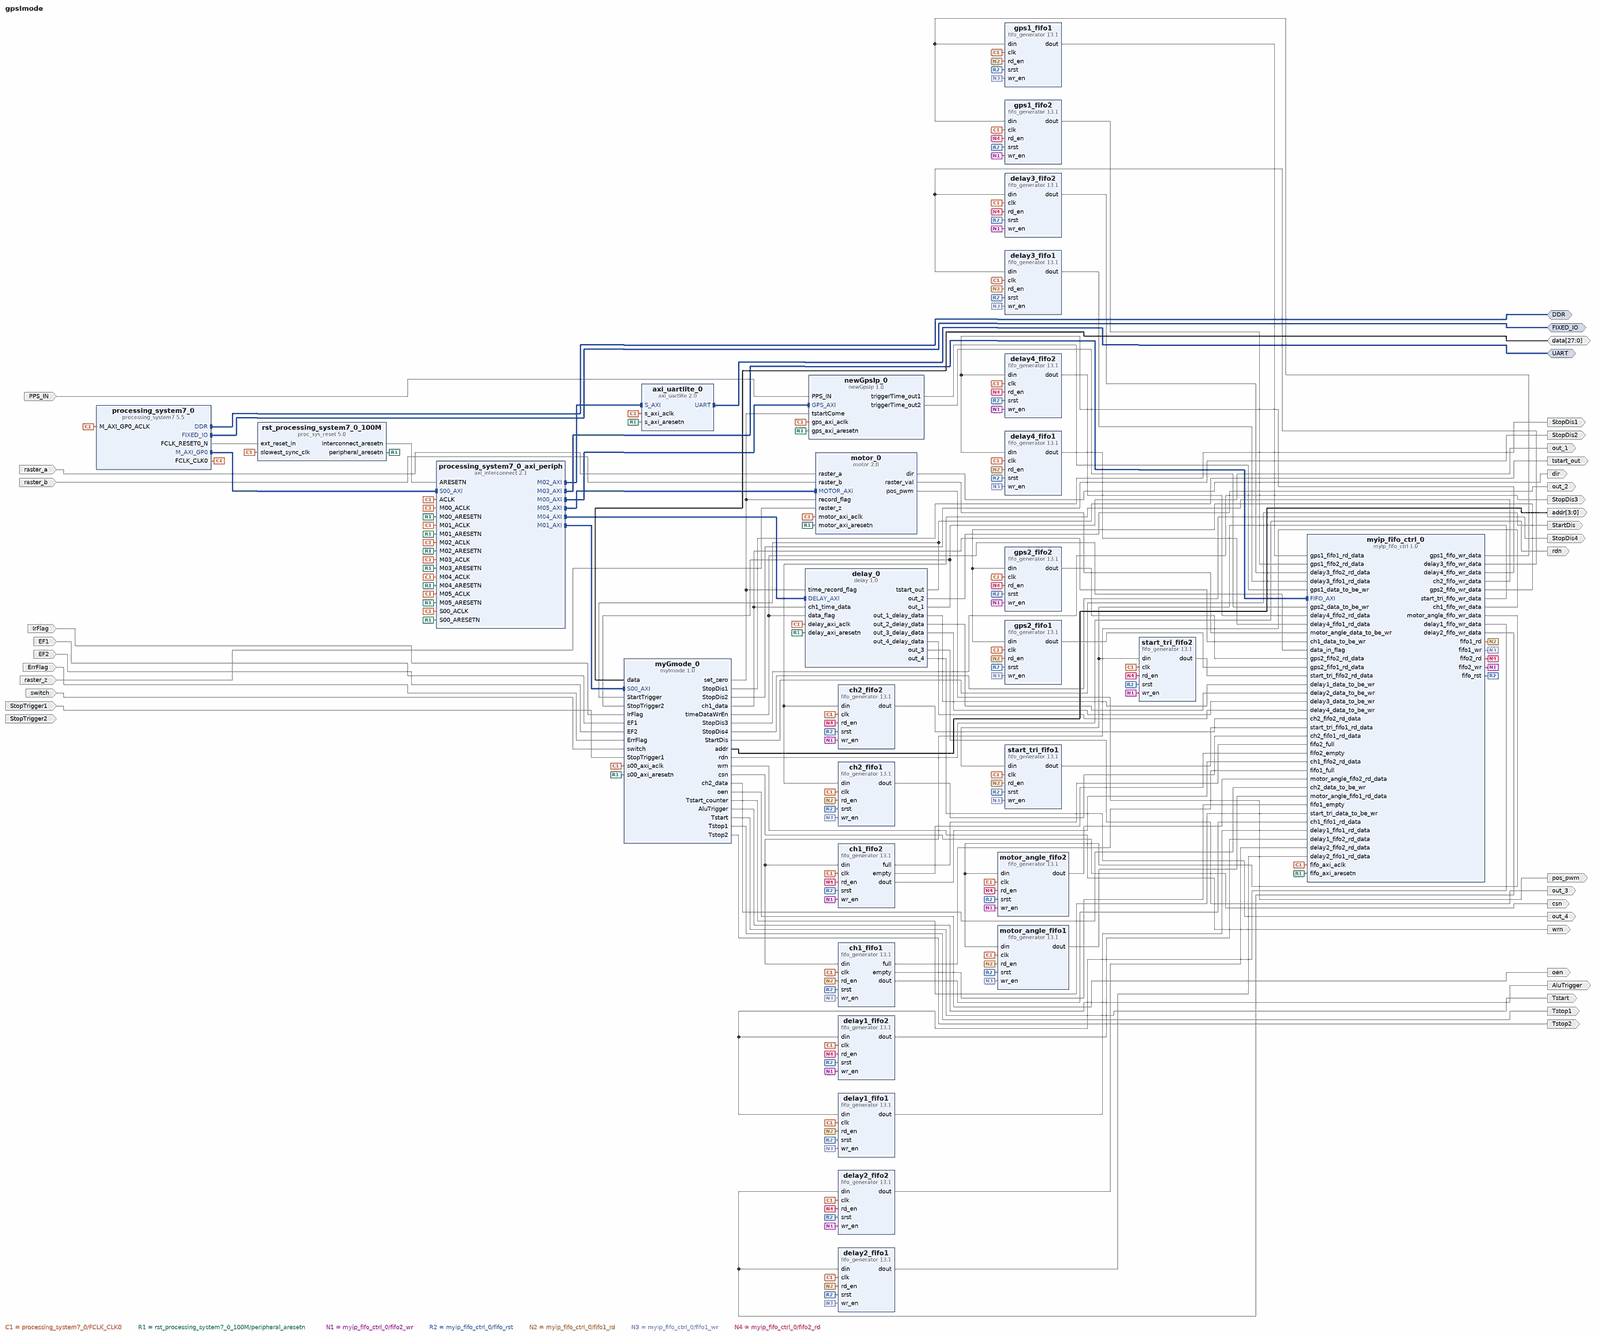
[diagram p0: block diagram of the top level, whole]
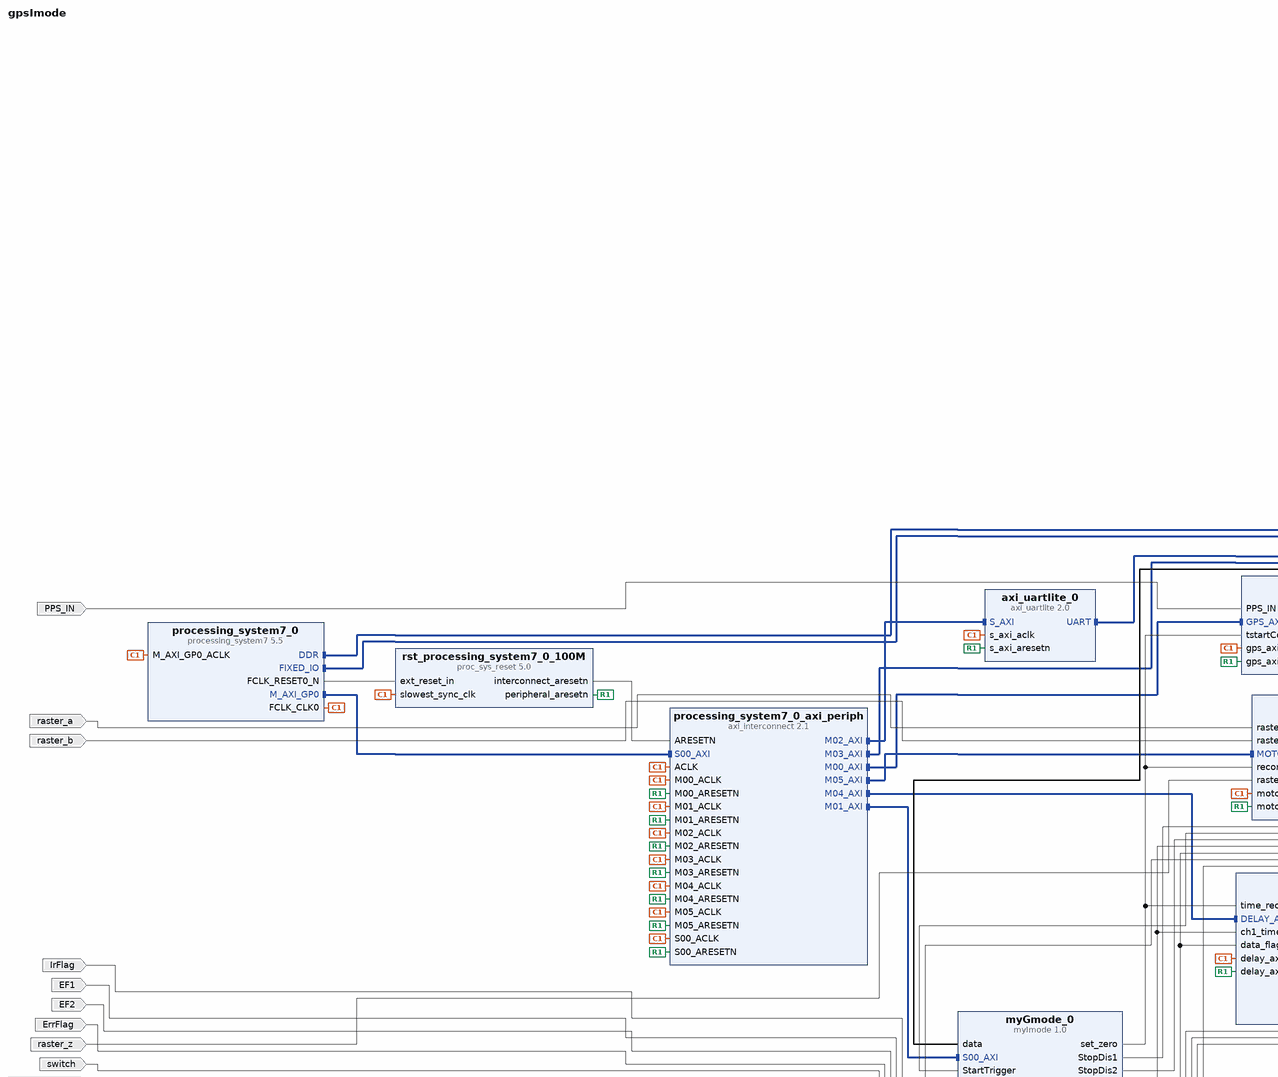
[diagram p1: block diagram of the top level, upper left part]
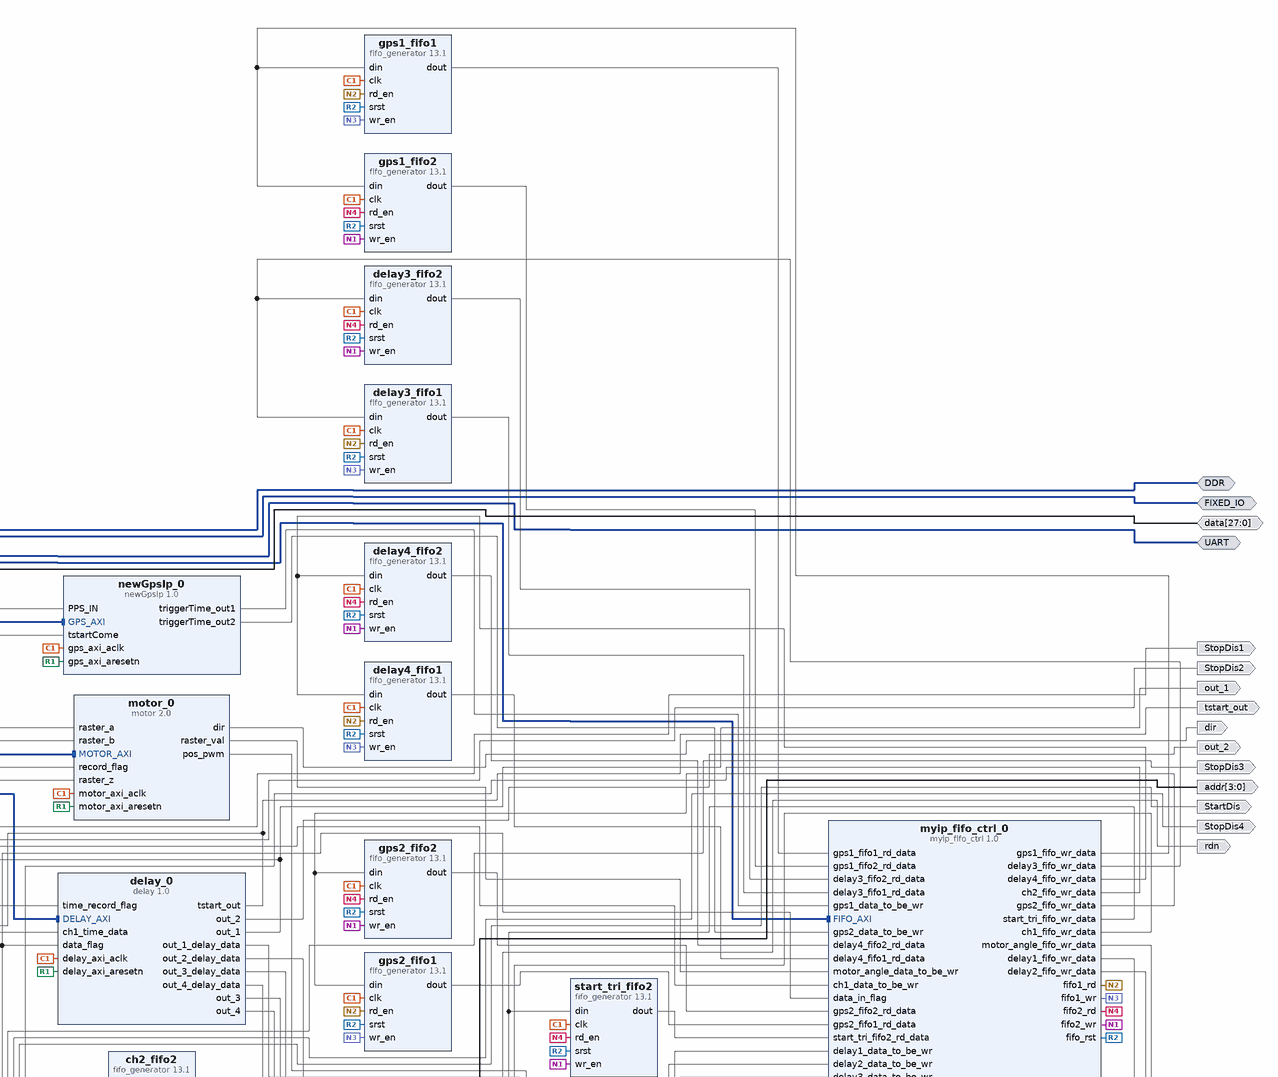
[diagram p2: block diagram of the top level, upper right part]
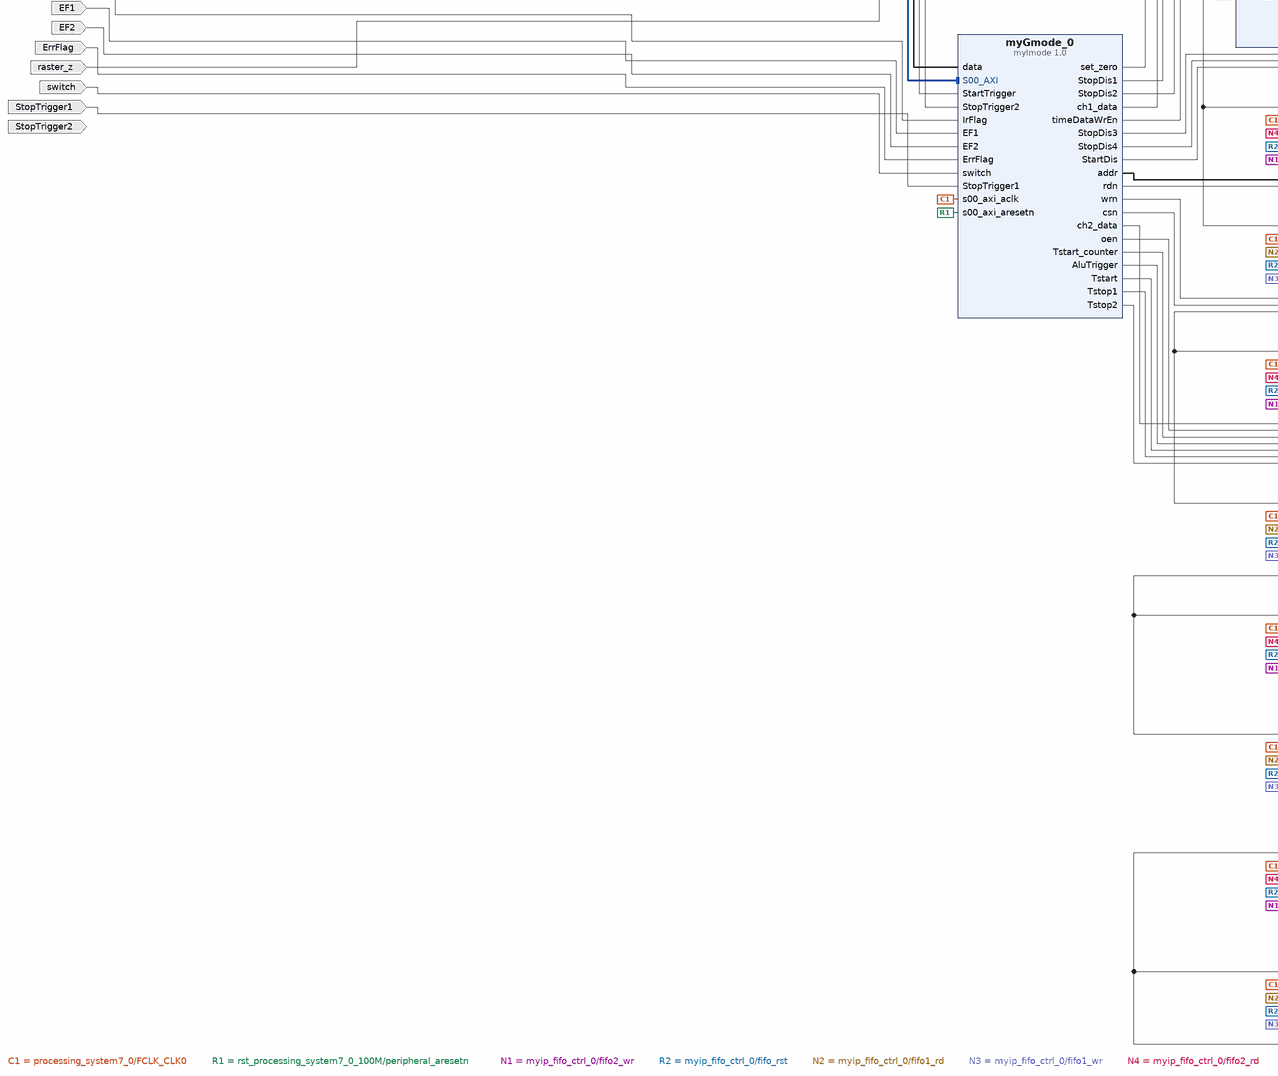
[diagram p3: block diagram of the top level, lower left part]
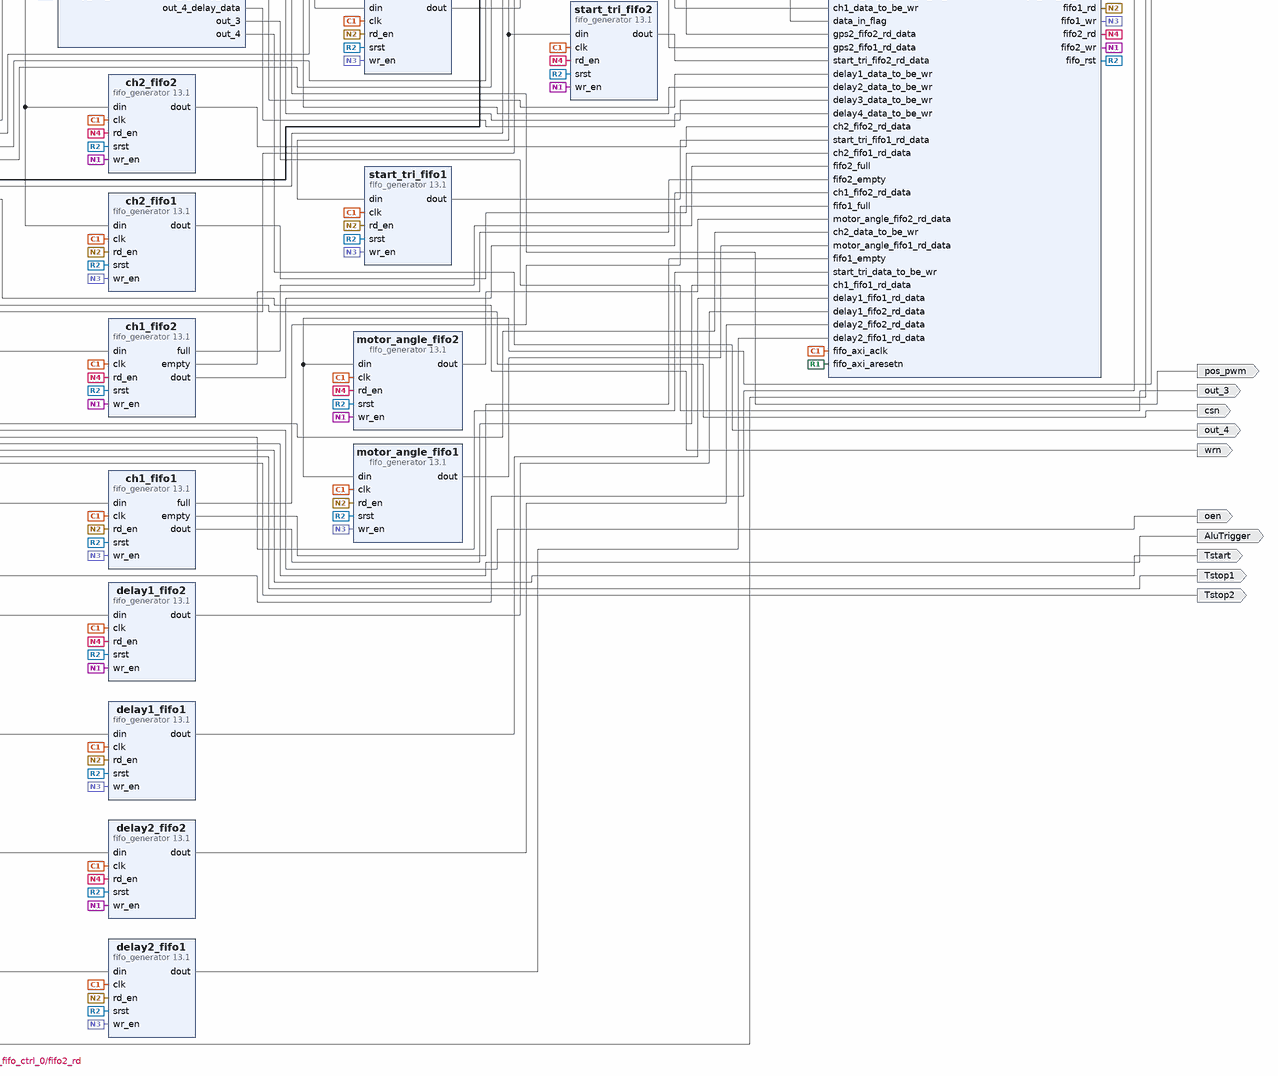
[diagram p4: block diagram of the top level, lower right part]
# Vivado block design gpsImode, Vivado 2016.2
create_bd_design gpsImode

create_bd_intf_port -mode Master -vlnv xilinx.com:interface:ddrx_rtl:1.0 DDR
create_bd_intf_port -mode Master -vlnv xilinx.com:display_processing_system7:fixedio_rtl:1.0 FIXED_IO
create_bd_intf_port -mode Master -vlnv xilinx.com:interface:uart_rtl:1.0 UART
create_bd_port -dir I StopTrigger2
create_bd_port -dir I PPS_IN
create_bd_port -dir I IrFlag
create_bd_port -dir I EF1
create_bd_port -dir O StopDis1
create_bd_port -dir O StopDis2
create_bd_port -dir O StopDis3
create_bd_port -dir O StopDis4
create_bd_port -dir O StartDis
create_bd_port -dir O -from 3 -to 0 addr
create_bd_port -dir IO -from 27 -to 0 data
create_bd_port -dir O wrn
create_bd_port -dir O rdn
create_bd_port -dir O csn
create_bd_port -dir O oen
create_bd_port -dir O AluTrigger
create_bd_port -dir O Tstart
create_bd_port -dir O Tstop1
create_bd_port -dir O Tstop2
create_bd_port -dir I EF2
create_bd_port -dir I ErrFlag
create_bd_port -dir I switch
create_bd_port -dir O out_2
create_bd_port -dir O out_3
create_bd_port -dir O tstart_out
create_bd_port -dir O out_1
create_bd_port -dir O out_4
create_bd_port -dir I StopTrigger1
create_bd_port -dir I raster_a
create_bd_port -dir I raster_b
create_bd_port -dir I raster_z
create_bd_port -dir O pos_pwm
create_bd_port -dir O dir

create_bd_cell -type ip -vlnv xilinx.com:ip:processing_system7:5.5 processing_system7_0
set_property -dict [list \
  CONFIG.PCW_USE_FABRIC_INTERRUPT 1 \
  CONFIG.PCW_IRQ_F2P_INTR 1 \
  CONFIG.PCW_QSPI_GRP_SINGLE_SS_ENABLE 1 \
  CONFIG.preset ZedBoard \
] [get_bd_cells processing_system7_0]
create_bd_cell -type ip -vlnv xilinx.com:ip:axi_uartlite:2.0 axi_uartlite_0
create_bd_cell -type ip -vlnv xilinx.com:ip:axi_interconnect:2.1 processing_system7_0_axi_periph
set_property -dict {CONFIG.NUM_MI 6} [get_bd_cells processing_system7_0_axi_periph]
create_bd_cell -type ip -vlnv xilinx.com:ip:proc_sys_reset:5.0 rst_processing_system7_0_100M
create_bd_cell -type ip -vlnv xilinx.com:ip:fifo_generator:13.1 ch1_fifo1
set_property -dict {CONFIG.Input_Data_Width 22 CONFIG.Input_Depth 8192 CONFIG.Output_Data_Width 22} [get_bd_cells ch1_fifo1]
create_bd_cell -type ip -vlnv xilinx.com:ip:fifo_generator:13.1 ch1_fifo2
set_property -dict {CONFIG.Input_Data_Width 22 CONFIG.Input_Depth 8192 CONFIG.Output_Data_Width 22} [get_bd_cells ch1_fifo2]
create_bd_cell -type ip -vlnv xilinx.com:ip:fifo_generator:13.1 ch2_fifo1
set_property -dict {CONFIG.Input_Data_Width 22 CONFIG.Input_Depth 8192 CONFIG.Output_Data_Width 22} [get_bd_cells ch2_fifo1]
create_bd_cell -type ip -vlnv xilinx.com:ip:fifo_generator:13.1 ch2_fifo2
set_property -dict {CONFIG.Input_Data_Width 22 CONFIG.Input_Depth 8192 CONFIG.Output_Data_Width 22} [get_bd_cells ch2_fifo2]
create_bd_cell -type ip -vlnv xilinx.com:ip:fifo_generator:13.1 gps1_fifo1
set_property -dict {CONFIG.Input_Data_Width 32 CONFIG.Input_Depth 8192 CONFIG.Output_Data_Width 32} [get_bd_cells gps1_fifo1]
create_bd_cell -type ip -vlnv xilinx.com:ip:fifo_generator:13.1 gps1_fifo2
set_property -dict {CONFIG.Input_Data_Width 32 CONFIG.Input_Depth 8192 CONFIG.Output_Data_Width 32} [get_bd_cells gps1_fifo2]
create_bd_cell -type ip -vlnv xilinx.com:ip:fifo_generator:13.1 gps2_fifo1
set_property -dict {CONFIG.Input_Data_Width 32 CONFIG.Input_Depth 8192 CONFIG.Output_Data_Width 32} [get_bd_cells gps2_fifo1]
create_bd_cell -type ip -vlnv xilinx.com:ip:fifo_generator:13.1 gps2_fifo2
set_property -dict {CONFIG.Input_Data_Width 32 CONFIG.Input_Depth 8192 CONFIG.Output_Data_Width 32} [get_bd_cells gps2_fifo2]
create_bd_cell -type ip -vlnv xilinx.com:ip:fifo_generator:13.1 start_tri_fifo1
set_property -dict {CONFIG.Input_Data_Width 32 CONFIG.Input_Depth 8192 CONFIG.Output_Data_Width 32} [get_bd_cells start_tri_fifo1]
create_bd_cell -type ip -vlnv xilinx.com:ip:fifo_generator:13.1 start_tri_fifo2
set_property -dict {CONFIG.Input_Data_Width 32 CONFIG.Input_Depth 8192 CONFIG.Output_Data_Width 32} [get_bd_cells start_tri_fifo2]
create_bd_cell -type ip -vlnv xilinx.com:user:newGpsIp:1.0 newGpsIp_0
create_bd_cell -type ip -vlnv xilinx.com:user:myImode:1.0 myGmode_0
create_bd_cell -type ip -vlnv xilinx.com:ip:fifo_generator:13.1 delay1_fifo1
set_property -dict {CONFIG.Input_Data_Width 15 CONFIG.Input_Depth 8192 CONFIG.Output_Data_Width 15} [get_bd_cells delay1_fifo1]
create_bd_cell -type ip -vlnv xilinx.com:ip:fifo_generator:13.1 delay1_fifo2
set_property -dict {CONFIG.Input_Data_Width 15 CONFIG.Input_Depth 8192 CONFIG.Output_Data_Width 15} [get_bd_cells delay1_fifo2]
create_bd_cell -type ip -vlnv xilinx.com:ip:fifo_generator:13.1 delay2_fifo1
set_property -dict {CONFIG.Input_Data_Width 15 CONFIG.Input_Depth 8192 CONFIG.Output_Data_Width 15} [get_bd_cells delay2_fifo1]
create_bd_cell -type ip -vlnv xilinx.com:ip:fifo_generator:13.1 delay2_fifo2
set_property -dict {CONFIG.Input_Data_Width 15 CONFIG.Input_Depth 8192 CONFIG.Output_Data_Width 15} [get_bd_cells delay2_fifo2]
create_bd_cell -type ip -vlnv xilinx.com:ip:fifo_generator:13.1 delay3_fifo1
set_property -dict {CONFIG.Input_Data_Width 15 CONFIG.Input_Depth 8192 CONFIG.Output_Data_Width 15} [get_bd_cells delay3_fifo1]
create_bd_cell -type ip -vlnv xilinx.com:ip:fifo_generator:13.1 delay3_fifo2
set_property -dict {CONFIG.Input_Data_Width 15 CONFIG.Input_Depth 8192 CONFIG.Output_Data_Width 15} [get_bd_cells delay3_fifo2]
create_bd_cell -type ip -vlnv xilinx.com:ip:fifo_generator:13.1 delay4_fifo1
set_property -dict {CONFIG.Input_Data_Width 15 CONFIG.Input_Depth 8192 CONFIG.Output_Data_Width 15} [get_bd_cells delay4_fifo1]
create_bd_cell -type ip -vlnv xilinx.com:ip:fifo_generator:13.1 delay4_fifo2
set_property -dict {CONFIG.Input_Data_Width 15 CONFIG.Input_Depth 8192 CONFIG.Output_Data_Width 15} [get_bd_cells delay4_fifo2]
create_bd_cell -type ip -vlnv xilinx.com:user:delay:1.0 delay_0
create_bd_cell -type ip -vlnv xilinx.com:user:myip_fifo_ctrl:1.0 myip_fifo_ctrl_0
create_bd_cell -type ip -vlnv xilinx.com:ip:fifo_generator:13.1 motor_angle_fifo1
set_property -dict [list \
  CONFIG.Input_Data_Width 32 \
  CONFIG.Input_Depth 8192 \
  CONFIG.Output_Data_Width 32 \
] [get_bd_cells motor_angle_fifo1]
create_bd_cell -type ip -vlnv xilinx.com:ip:fifo_generator:13.1 motor_angle_fifo2
set_property -dict [list \
  CONFIG.Input_Data_Width 32 \
  CONFIG.Input_Depth 8192 \
  CONFIG.Output_Data_Width 32 \
] [get_bd_cells motor_angle_fifo2]
create_bd_cell -type ip -vlnv xilinx.com:user:motor:2.0 motor_0

# ---- connections ----

connect_bd_intf_net [get_bd_intf_pins processing_system7_0/M_AXI_GP0] [get_bd_intf_pins processing_system7_0_axi_periph/S00_AXI]
connect_bd_intf_net [get_bd_intf_pins processing_system7_0_axi_periph/M00_AXI] [get_bd_intf_pins newGpsIp_0/GPS_AXI]
connect_bd_intf_net [get_bd_intf_pins processing_system7_0_axi_periph/M02_AXI] [get_bd_intf_pins axi_uartlite_0/S_AXI]
connect_bd_intf_net [get_bd_intf_pins processing_system7_0_axi_periph/M01_AXI] [get_bd_intf_pins myGmode_0/S00_AXI]
connect_bd_intf_net [get_bd_intf_pins processing_system7_0_axi_periph/M03_AXI] [get_bd_intf_pins myip_fifo_ctrl_0/FIFO_AXI]
connect_bd_intf_net [get_bd_intf_pins processing_system7_0_axi_periph/M04_AXI] [get_bd_intf_pins delay_0/DELAY_AXI]
connect_bd_intf_net [get_bd_intf_pins processing_system7_0_axi_periph/M05_AXI] [get_bd_intf_pins motor_0/MOTOR_AXI]
connect_bd_intf_net [get_bd_intf_ports DDR] [get_bd_intf_pins processing_system7_0/DDR]
connect_bd_intf_net [get_bd_intf_ports FIXED_IO] [get_bd_intf_pins processing_system7_0/FIXED_IO]
connect_bd_intf_net [get_bd_intf_ports UART] [get_bd_intf_pins axi_uartlite_0/UART]
connect_bd_net [get_bd_ports PPS_IN] [get_bd_pins newGpsIp_0/PPS_IN]
connect_bd_net [get_bd_pins processing_system7_0/FCLK_CLK0] \
  [get_bd_pins processing_system7_0/M_AXI_GP0_ACLK] [get_bd_pins rst_processing_system7_0_100M/slowest_sync_clk] \
  [get_bd_pins axi_uartlite_0/s_axi_aclk] [get_bd_pins ch1_fifo1/clk] [get_bd_pins ch2_fifo1/clk] \
  [get_bd_pins gps2_fifo1/clk] [get_bd_pins start_tri_fifo1/clk] [get_bd_pins ch1_fifo2/clk] [get_bd_pins ch2_fifo2/clk] \
  [get_bd_pins gps1_fifo2/clk] [get_bd_pins gps2_fifo2/clk] [get_bd_pins start_tri_fifo2/clk] [get_bd_pins gps1_fifo1/clk] \
  [get_bd_pins newGpsIp_0/gps_axi_aclk] [get_bd_pins myGmode_0/s00_axi_aclk] [get_bd_pins delay1_fifo1/clk] \
  [get_bd_pins delay1_fifo2/clk] [get_bd_pins delay2_fifo1/clk] [get_bd_pins delay2_fifo2/clk] [get_bd_pins delay3_fifo1/clk] \
  [get_bd_pins delay3_fifo2/clk] [get_bd_pins delay4_fifo1/clk] [get_bd_pins delay4_fifo2/clk] \
  [get_bd_pins delay_0/delay_axi_aclk] [get_bd_pins myip_fifo_ctrl_0/fifo_axi_aclk] [get_bd_pins motor_angle_fifo1/clk] \
  [get_bd_pins motor_angle_fifo2/clk] [get_bd_pins processing_system7_0_axi_periph/S00_ACLK] \
  [get_bd_pins processing_system7_0_axi_periph/ACLK] [get_bd_pins processing_system7_0_axi_periph/M00_ACLK] \
  [get_bd_pins processing_system7_0_axi_periph/M01_ACLK] [get_bd_pins processing_system7_0_axi_periph/M02_ACLK] \
  [get_bd_pins processing_system7_0_axi_periph/M03_ACLK] [get_bd_pins processing_system7_0_axi_periph/M04_ACLK] \
  [get_bd_pins processing_system7_0_axi_periph/M05_ACLK] [get_bd_pins motor_0/motor_axi_aclk]
connect_bd_net [get_bd_pins processing_system7_0/FCLK_RESET0_N] [get_bd_pins rst_processing_system7_0_100M/ext_reset_in]
connect_bd_net [get_bd_pins rst_processing_system7_0_100M/peripheral_aresetn] \
  [get_bd_pins axi_uartlite_0/s_axi_aresetn] [get_bd_pins newGpsIp_0/gps_axi_aresetn] [get_bd_pins myGmode_0/s00_axi_aresetn] \
  [get_bd_pins delay_0/delay_axi_aresetn] [get_bd_pins myip_fifo_ctrl_0/fifo_axi_aresetn] \
  [get_bd_pins processing_system7_0_axi_periph/S00_ARESETN] [get_bd_pins processing_system7_0_axi_periph/M00_ARESETN] \
  [get_bd_pins processing_system7_0_axi_periph/M01_ARESETN] [get_bd_pins processing_system7_0_axi_periph/M02_ARESETN] \
  [get_bd_pins processing_system7_0_axi_periph/M03_ARESETN] [get_bd_pins processing_system7_0_axi_periph/M04_ARESETN] \
  [get_bd_pins processing_system7_0_axi_periph/M05_ARESETN] [get_bd_pins motor_0/motor_axi_aresetn]
connect_bd_net [get_bd_pins rst_processing_system7_0_100M/interconnect_aresetn] [get_bd_pins processing_system7_0_axi_periph/ARESETN]
connect_bd_net [get_bd_ports IrFlag] [get_bd_pins myGmode_0/IrFlag]
connect_bd_net -net EF1_1 [get_bd_ports EF1] [get_bd_pins myGmode_0/EF1]
connect_bd_net -net myImode_0_StopDis1 [get_bd_pins myGmode_0/StopDis1] [get_bd_ports StopDis1]
connect_bd_net -net myImode_0_StopDis2 [get_bd_pins myGmode_0/StopDis2] [get_bd_ports StopDis2]
connect_bd_net -net myImode_0_StopDis3 [get_bd_pins myGmode_0/StopDis3] [get_bd_ports StopDis3]
connect_bd_net -net myImode_0_StopDis4 [get_bd_pins myGmode_0/StopDis4] [get_bd_ports StopDis4]
connect_bd_net -net myImode_0_StartDis [get_bd_pins myGmode_0/StartDis] [get_bd_ports StartDis]
connect_bd_net -net myImode_0_addr [get_bd_pins myGmode_0/addr] [get_bd_ports addr]
connect_bd_net [get_bd_ports data] [get_bd_pins myGmode_0/data]
connect_bd_net -net myImode_0_wrn [get_bd_pins myGmode_0/wrn] [get_bd_ports wrn]
connect_bd_net -net myImode_0_rdn [get_bd_pins myGmode_0/rdn] [get_bd_ports rdn]
connect_bd_net -net myImode_0_csn [get_bd_pins myGmode_0/csn] [get_bd_ports csn]
connect_bd_net -net myImode_0_oen [get_bd_pins myGmode_0/oen] [get_bd_ports oen]
connect_bd_net -net myImode_0_AluTrigger [get_bd_pins myGmode_0/AluTrigger] [get_bd_ports AluTrigger]
connect_bd_net -net myImode_0_Tstart [get_bd_pins myGmode_0/Tstart] [get_bd_ports Tstart]
connect_bd_net -net myImode_0_Tstop1 [get_bd_pins myGmode_0/Tstop1] [get_bd_ports Tstop1]
connect_bd_net -net myImode_0_Tstop2 [get_bd_pins myGmode_0/Tstop2] [get_bd_ports Tstop2]
connect_bd_net -net myImode_0_set_zero [get_bd_pins myGmode_0/set_zero] \
  [get_bd_pins newGpsIp_0/tstartCome] [get_bd_pins delay_0/time_record_flag] [get_bd_pins motor_0/record_flag]
connect_bd_net -net EF2_1 [get_bd_ports EF2] [get_bd_pins myGmode_0/EF2]
connect_bd_net [get_bd_ports ErrFlag] [get_bd_pins myGmode_0/ErrFlag]
connect_bd_net [get_bd_pins myip_fifo_ctrl_0/ch1_fifo_wr_data] [get_bd_pins ch1_fifo1/din] [get_bd_pins ch1_fifo2/din]
connect_bd_net [get_bd_pins myip_fifo_ctrl_0/ch2_fifo_wr_data] [get_bd_pins ch2_fifo1/din] [get_bd_pins ch2_fifo2/din]
connect_bd_net [get_bd_pins myip_fifo_ctrl_0/gps1_fifo_wr_data] [get_bd_pins gps1_fifo1/din] [get_bd_pins gps1_fifo2/din]
connect_bd_net [get_bd_pins myip_fifo_ctrl_0/gps2_fifo_wr_data] [get_bd_pins gps2_fifo1/din] [get_bd_pins gps2_fifo2/din]
connect_bd_net [get_bd_pins myip_fifo_ctrl_0/start_tri_fifo_wr_data] [get_bd_pins start_tri_fifo1/din] [get_bd_pins start_tri_fifo2/din]
connect_bd_net -net myip_fifo_ctrl_0_start_tri_fifo2_wr [get_bd_pins myip_fifo_ctrl_0/fifo2_wr] \
  [get_bd_pins start_tri_fifo2/wr_en] [get_bd_pins ch1_fifo2/wr_en] [get_bd_pins ch2_fifo2/wr_en] \
  [get_bd_pins gps2_fifo2/wr_en] [get_bd_pins gps1_fifo2/wr_en] [get_bd_pins delay2_fifo2/wr_en] \
  [get_bd_pins delay3_fifo2/wr_en] [get_bd_pins delay4_fifo2/wr_en] [get_bd_pins delay1_fifo2/wr_en] \
  [get_bd_pins motor_angle_fifo2/wr_en]
connect_bd_net -net fifo_generator_0_full [get_bd_pins ch1_fifo1/full] [get_bd_pins myip_fifo_ctrl_0/fifo1_full]
connect_bd_net -net fifo_generator_1_full [get_bd_pins ch1_fifo2/full] [get_bd_pins myip_fifo_ctrl_0/fifo2_full]
connect_bd_net -net fifo_generator_0_empty [get_bd_pins ch1_fifo1/empty] [get_bd_pins myip_fifo_ctrl_0/fifo1_empty]
connect_bd_net -net fifo_generator_1_empty [get_bd_pins ch1_fifo2/empty] [get_bd_pins myip_fifo_ctrl_0/fifo2_empty]
connect_bd_net -net fifo_generator_0_dout [get_bd_pins ch1_fifo1/dout] [get_bd_pins myip_fifo_ctrl_0/ch1_fifo1_rd_data]
connect_bd_net [get_bd_pins myip_fifo_ctrl_0/fifo_rst] \
  [get_bd_pins ch1_fifo1/srst] [get_bd_pins ch2_fifo1/srst] [get_bd_pins gps2_fifo1/srst] [get_bd_pins start_tri_fifo1/srst] \
  [get_bd_pins ch1_fifo2/srst] [get_bd_pins ch2_fifo2/srst] [get_bd_pins gps1_fifo2/srst] [get_bd_pins gps2_fifo2/srst] \
  [get_bd_pins start_tri_fifo2/srst] [get_bd_pins gps1_fifo1/srst] [get_bd_pins delay1_fifo1/srst] \
  [get_bd_pins delay1_fifo2/srst] [get_bd_pins delay2_fifo1/srst] [get_bd_pins delay2_fifo2/srst] \
  [get_bd_pins delay3_fifo1/srst] [get_bd_pins delay3_fifo2/srst] [get_bd_pins delay4_fifo1/srst] \
  [get_bd_pins delay4_fifo2/srst] [get_bd_pins motor_angle_fifo1/srst] [get_bd_pins motor_angle_fifo2/srst]
connect_bd_net -net fifo_generator_2_dout [get_bd_pins ch2_fifo1/dout] [get_bd_pins myip_fifo_ctrl_0/ch2_fifo1_rd_data]
connect_bd_net -net fifo_generator_16_dout [get_bd_pins gps1_fifo1/dout] [get_bd_pins myip_fifo_ctrl_0/gps1_fifo1_rd_data]
connect_bd_net -net fifo_generator_18_dout [get_bd_pins gps2_fifo1/dout] [get_bd_pins myip_fifo_ctrl_0/gps2_fifo1_rd_data]
connect_bd_net -net fifo_generator_20_dout [get_bd_pins start_tri_fifo1/dout] [get_bd_pins myip_fifo_ctrl_0/start_tri_fifo1_rd_data]
connect_bd_net -net myip_fifo_ctrl_0_start_tri_fifo1_rd [get_bd_pins myip_fifo_ctrl_0/fifo1_rd] \
  [get_bd_pins start_tri_fifo1/rd_en] [get_bd_pins gps2_fifo1/rd_en] [get_bd_pins ch1_fifo1/rd_en] \
  [get_bd_pins gps1_fifo1/rd_en] [get_bd_pins ch2_fifo1/rd_en] [get_bd_pins delay2_fifo1/rd_en] \
  [get_bd_pins delay1_fifo1/rd_en] [get_bd_pins delay3_fifo1/rd_en] [get_bd_pins delay4_fifo1/rd_en] \
  [get_bd_pins motor_angle_fifo1/rd_en]
connect_bd_net -net fifo_generator_1_dout [get_bd_pins ch1_fifo2/dout] [get_bd_pins myip_fifo_ctrl_0/ch1_fifo2_rd_data]
connect_bd_net -net fifo_generator_17_dout [get_bd_pins gps1_fifo2/dout] [get_bd_pins myip_fifo_ctrl_0/gps1_fifo2_rd_data]
connect_bd_net -net fifo_generator_19_dout [get_bd_pins gps2_fifo2/dout] [get_bd_pins myip_fifo_ctrl_0/gps2_fifo2_rd_data]
connect_bd_net -net fifo_generator_21_dout [get_bd_pins start_tri_fifo2/dout] [get_bd_pins myip_fifo_ctrl_0/start_tri_fifo2_rd_data]
connect_bd_net -net myImode_0_ch1_data [get_bd_pins myGmode_0/ch1_data] \
  [get_bd_pins delay_0/ch1_time_data] [get_bd_pins myip_fifo_ctrl_0/ch1_data_to_be_wr]
connect_bd_net -net myImode_0_ch2_data [get_bd_pins myGmode_0/ch2_data] [get_bd_pins myip_fifo_ctrl_0/ch2_data_to_be_wr]
connect_bd_net -net myImode_0_Tstart_counter [get_bd_pins myGmode_0/Tstart_counter] [get_bd_pins myip_fifo_ctrl_0/start_tri_data_to_be_wr]
connect_bd_net [get_bd_pins newGpsIp_0/triggerTime_out1] [get_bd_pins myip_fifo_ctrl_0/gps1_data_to_be_wr]
connect_bd_net [get_bd_pins newGpsIp_0/triggerTime_out2] [get_bd_pins myip_fifo_ctrl_0/gps2_data_to_be_wr]
connect_bd_net -net myImode_0_timeDataWrEn [get_bd_pins myGmode_0/timeDataWrEn] \
  [get_bd_pins delay_0/data_flag] [get_bd_pins myip_fifo_ctrl_0/data_in_flag]
connect_bd_net [get_bd_pins myip_fifo_ctrl_0/fifo1_wr] \
  [get_bd_pins ch2_fifo1/wr_en] [get_bd_pins gps1_fifo1/wr_en] [get_bd_pins ch1_fifo1/wr_en] [get_bd_pins gps2_fifo1/wr_en] \
  [get_bd_pins start_tri_fifo1/wr_en] [get_bd_pins delay2_fifo1/wr_en] [get_bd_pins delay1_fifo1/wr_en] \
  [get_bd_pins delay3_fifo1/wr_en] [get_bd_pins delay4_fifo1/wr_en] [get_bd_pins motor_angle_fifo1/wr_en]
connect_bd_net [get_bd_pins ch2_fifo2/dout] [get_bd_pins myip_fifo_ctrl_0/ch2_fifo2_rd_data]
connect_bd_net [get_bd_ports switch] [get_bd_pins myGmode_0/switch]
connect_bd_net [get_bd_pins delay_0/out_2] [get_bd_ports out_2]
connect_bd_net [get_bd_pins delay_0/out_3] [get_bd_ports out_3]
connect_bd_net [get_bd_pins delay_0/tstart_out] [get_bd_ports tstart_out] [get_bd_pins myGmode_0/StartTrigger]
connect_bd_net [get_bd_pins delay_0/out_1] [get_bd_ports out_1] [get_bd_pins myGmode_0/StopTrigger2]
connect_bd_net [get_bd_pins delay_0/out_4] [get_bd_ports out_4]
connect_bd_net -net StopTrigger1_1 [get_bd_ports StopTrigger1] [get_bd_pins myGmode_0/StopTrigger1]
connect_bd_net -net myip_fifo_ctrl_0_gps2_fifo2_rd [get_bd_pins myip_fifo_ctrl_0/fifo2_rd] \
  [get_bd_pins gps2_fifo2/rd_en] [get_bd_pins start_tri_fifo2/rd_en] [get_bd_pins ch1_fifo2/rd_en] \
  [get_bd_pins ch2_fifo2/rd_en] [get_bd_pins gps1_fifo2/rd_en] [get_bd_pins delay2_fifo2/rd_en] \
  [get_bd_pins delay3_fifo2/rd_en] [get_bd_pins delay4_fifo2/rd_en] [get_bd_pins delay1_fifo2/rd_en] \
  [get_bd_pins motor_angle_fifo2/rd_en]
connect_bd_net [get_bd_pins delay_0/out_1_delay_data] [get_bd_pins myip_fifo_ctrl_0/delay1_data_to_be_wr]
connect_bd_net [get_bd_pins delay_0/out_2_delay_data] [get_bd_pins myip_fifo_ctrl_0/delay2_data_to_be_wr]
connect_bd_net [get_bd_pins delay_0/out_3_delay_data] [get_bd_pins myip_fifo_ctrl_0/delay3_data_to_be_wr]
connect_bd_net [get_bd_pins delay_0/out_4_delay_data] [get_bd_pins myip_fifo_ctrl_0/delay4_data_to_be_wr]
connect_bd_net [get_bd_pins delay4_fifo2/dout] [get_bd_pins myip_fifo_ctrl_0/delay4_fifo2_rd_data]
connect_bd_net [get_bd_pins delay4_fifo1/dout] [get_bd_pins myip_fifo_ctrl_0/delay4_fifo1_rd_data]
connect_bd_net [get_bd_pins delay3_fifo2/dout] [get_bd_pins myip_fifo_ctrl_0/delay3_fifo2_rd_data]
connect_bd_net [get_bd_pins delay3_fifo1/dout] [get_bd_pins myip_fifo_ctrl_0/delay3_fifo1_rd_data]
connect_bd_net [get_bd_pins delay1_fifo1/dout] [get_bd_pins myip_fifo_ctrl_0/delay1_fifo1_rd_data]
connect_bd_net [get_bd_pins delay2_fifo1/dout] [get_bd_pins myip_fifo_ctrl_0/delay2_fifo1_rd_data]
connect_bd_net [get_bd_pins delay1_fifo2/dout] [get_bd_pins myip_fifo_ctrl_0/delay1_fifo2_rd_data]
connect_bd_net [get_bd_pins delay2_fifo2/dout] [get_bd_pins myip_fifo_ctrl_0/delay2_fifo2_rd_data]
connect_bd_net [get_bd_pins myip_fifo_ctrl_0/delay1_fifo_wr_data] [get_bd_pins delay1_fifo2/din] [get_bd_pins delay1_fifo1/din]
connect_bd_net [get_bd_pins myip_fifo_ctrl_0/delay2_fifo_wr_data] [get_bd_pins delay2_fifo1/din] [get_bd_pins delay2_fifo2/din]
connect_bd_net [get_bd_pins myip_fifo_ctrl_0/delay3_fifo_wr_data] [get_bd_pins delay3_fifo2/din] [get_bd_pins delay3_fifo1/din]
connect_bd_net [get_bd_pins myip_fifo_ctrl_0/delay4_fifo_wr_data] [get_bd_pins delay4_fifo1/din] [get_bd_pins delay4_fifo2/din]
connect_bd_net [get_bd_pins myip_fifo_ctrl_0/motor_angle_fifo_wr_data] [get_bd_pins motor_angle_fifo2/din] [get_bd_pins motor_angle_fifo1/din]
connect_bd_net [get_bd_pins motor_angle_fifo1/dout] [get_bd_pins myip_fifo_ctrl_0/motor_angle_fifo1_rd_data]
connect_bd_net [get_bd_pins motor_angle_fifo2/dout] [get_bd_pins myip_fifo_ctrl_0/motor_angle_fifo2_rd_data]
connect_bd_net [get_bd_pins motor_0/raster_val] [get_bd_pins myip_fifo_ctrl_0/motor_angle_data_to_be_wr]
connect_bd_net [get_bd_ports raster_a] [get_bd_pins motor_0/raster_a]
connect_bd_net [get_bd_ports raster_b] [get_bd_pins motor_0/raster_b]
connect_bd_net [get_bd_ports raster_z] [get_bd_pins motor_0/raster_z]
connect_bd_net [get_bd_pins motor_0/pos_pwm] [get_bd_ports pos_pwm]
connect_bd_net [get_bd_pins motor_0/dir] [get_bd_ports dir]

# ---- address map ----
assign_bd_address -offset 0x42C00000 -range 64K -target_address_space [get_bd_addr_spaces processing_system7_0/Data] [get_bd_addr_segs axi_uartlite_0/S_AXI/Reg]
assign_bd_address -offset 0x43C00000 -range 64K -target_address_space [get_bd_addr_spaces processing_system7_0/Data] [get_bd_addr_segs newGpsIp_0/GPS_AXI/GPS_AXI_reg]
assign_bd_address -offset 0x43C10000 -range 64K -target_address_space [get_bd_addr_spaces processing_system7_0/Data] [get_bd_addr_segs myGmode_0/S00_AXI/S00_AXI_reg]
assign_bd_address -offset 0x43C20000 -range 64K -target_address_space [get_bd_addr_spaces processing_system7_0/Data] [get_bd_addr_segs myip_fifo_ctrl_0/FIFO_AXI/FIFO_AXI_reg]
assign_bd_address -offset 0x43C30000 -range 64K -target_address_space [get_bd_addr_spaces processing_system7_0/Data] [get_bd_addr_segs delay_0/DELAY_AXI/DELAY_AXI_reg]
assign_bd_address -offset 0x43C40000 -range 64K -target_address_space [get_bd_addr_spaces processing_system7_0/Data] [get_bd_addr_segs motor_0/MOTOR_AXI/MOTOR_AXI_reg]

validate_bd_design
save_bd_design
